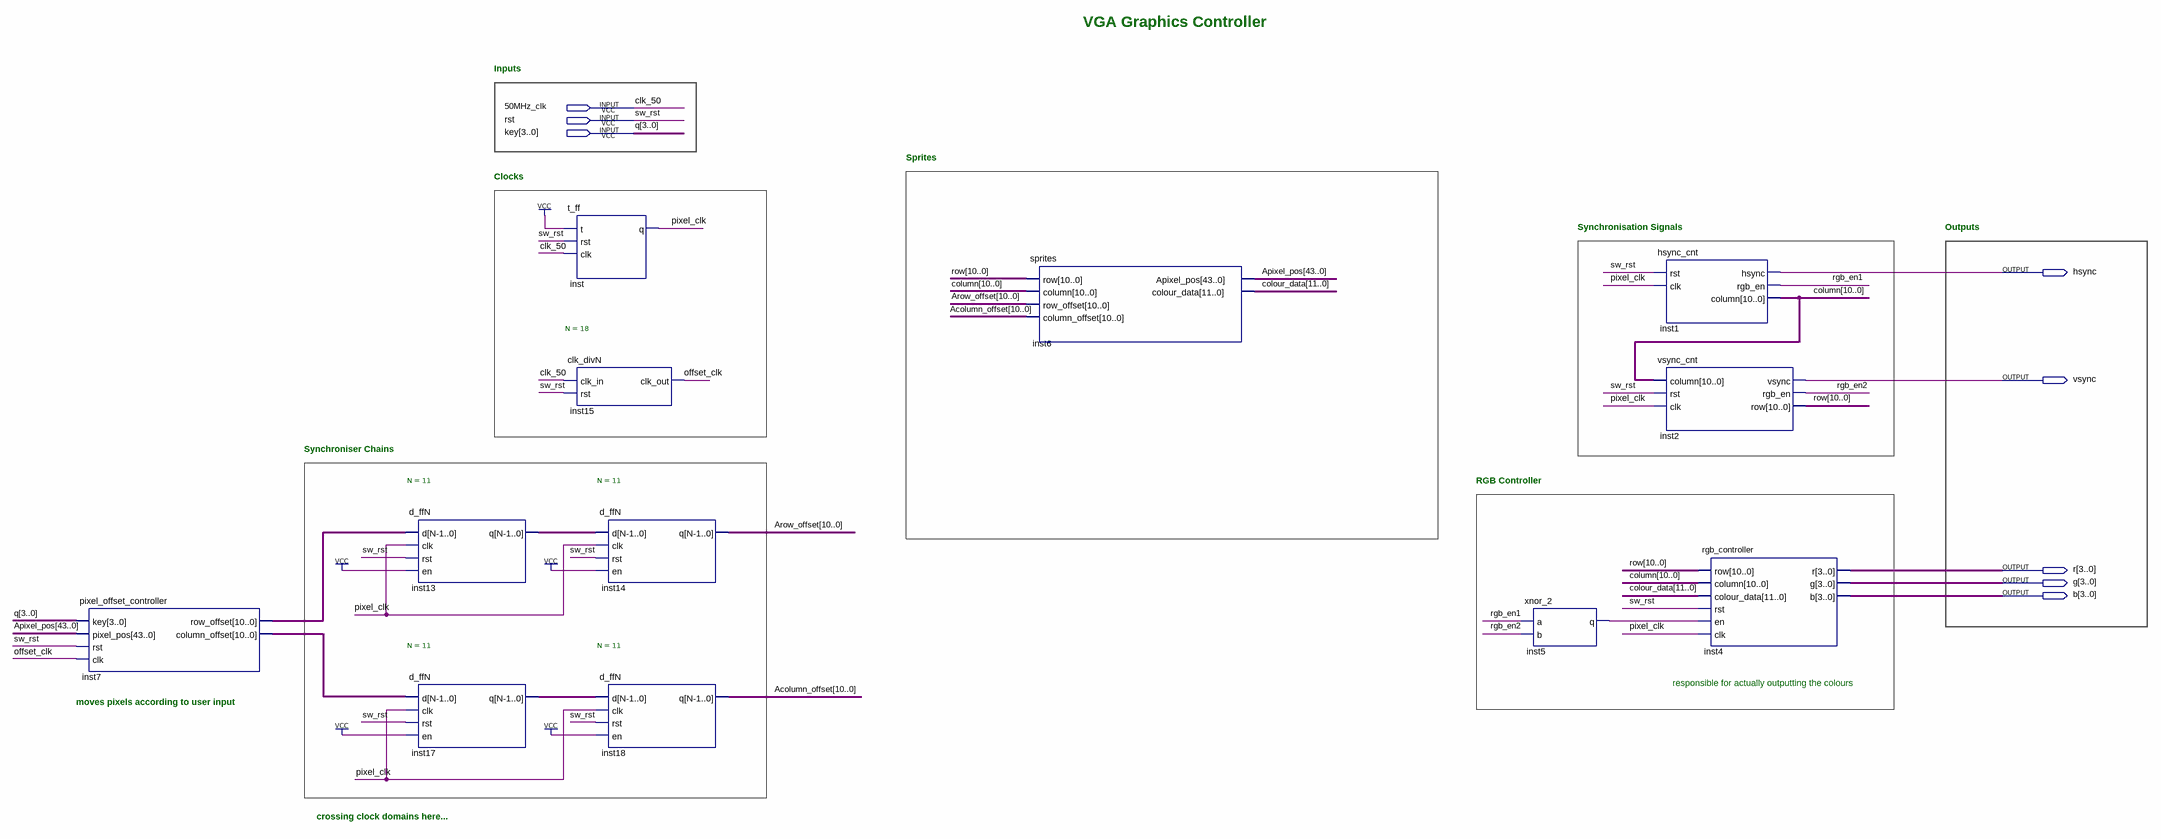
[diagram p0: schematic sheet]
// Quartus schematic VGA_controller.bdf as structural Verilog: 12 symbols, 8 pins
module VGA_controller (
  input  \50MHz_clk ,
  input  rst,
  input  [3:0] key,
  output hsync,
  output vsync,
  output [3:0] r,
  output [3:0] g,
  output [3:0] b
);

  wire inst5_q, offset_clk, pixel_clk, rgb_en1, rgb_en2;
  wire [10:0] Acolumn_offset, Arow_offset, column, inst7_column_offset, inst7_row_offset, inst13_q, inst17_q,
       row;
  wire [11:0] colour_data;
  wire [43:0] Apixel_pos;

  pixel_offset_controller inst7 (
    .key(key), .pixel_pos(Apixel_pos), .rst(rst), .clk(offset_clk), .row_offset(inst7_row_offset),
    .column_offset(inst7_column_offset));
  d_ffN #(.N(11)) inst13 (.d(inst7_row_offset), .clk(pixel_clk), .rst(rst), .en(1'b1), .q(inst13_q));
  d_ffN #(.N(11)) inst17 (.d(inst7_column_offset), .clk(pixel_clk), .rst(rst), .en(1'b1), .q(inst17_q));
  t_ff inst (.t(1'b1), .rst(rst), .clk(\50MHz_clk ), .q(pixel_clk));
  clk_divN #(.N(18)) inst15 (.clk_in(\50MHz_clk ), .rst(rst), .clk_out(offset_clk));
  d_ffN #(.N(11)) inst14 (.d(inst13_q), .clk(pixel_clk), .rst(rst), .en(1'b1), .q(Arow_offset));
  d_ffN #(.N(11)) inst18 (.d(inst17_q), .clk(pixel_clk), .rst(rst), .en(1'b1), .q(Acolumn_offset));
  sprites inst6 (
    .row(row), .column(column), .row_offset(Arow_offset), .column_offset(Acolumn_offset),
    .Apixel_pos(Apixel_pos), .colour_data(colour_data));
  xnor_2 inst5 (.a(rgb_en1), .b(rgb_en2), .q(inst5_q));
  hsync_cnt inst1 (.rst(rst), .clk(pixel_clk), .hsync(hsync), .rgb_en(rgb_en1), .column(column));
  vsync_cnt inst2 (.column(column), .rst(rst), .clk(pixel_clk), .vsync(vsync), .rgb_en(rgb_en2), .row(row));
  rgb_controller inst4 (
    .row(row), .column(column), .colour_data(colour_data), .rst(rst), .en(inst5_q), .clk(pixel_clk), .r(r),
    .g(g), .b(b));

  // Other names for the same wires on the sheet: clk_50 = \50MHz_clk ; q[3:0] = key; sw_rst = rst

  // Notes on the sheet:
  //   VGA Graphics Controller
  //   Inputs
  //   Sprites
  //   Clocks
  //   Synchronisation Signals
  //   Outputs
  //   Synchroniser Chains
  //   RGB Controller
  //   responsible for actually outputting the colours
  //   moves pixels according to user input
  //   crossing clock domains here...
endmodule
